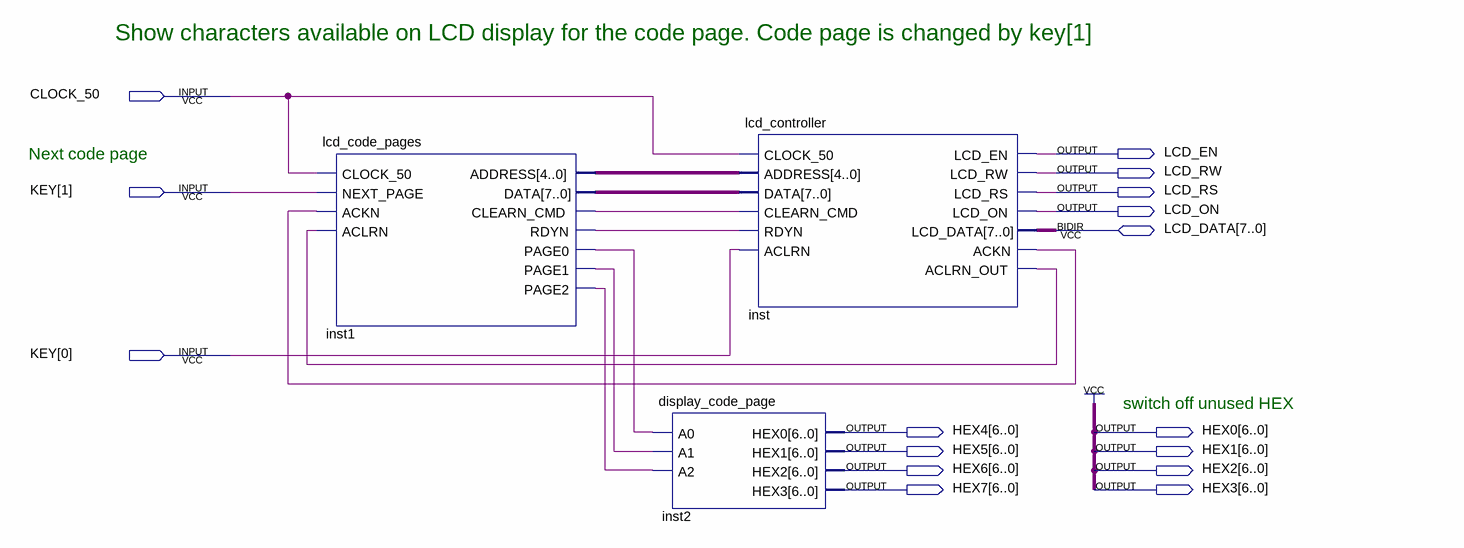
[diagram p0: schematic sheet]
// Quartus schematic lcd_demo_code_pages.bdf as structural Verilog: 3 symbols, 16 pins
module lcd_demo_code_pages (
  input  CLOCK_50,
  input  [1:0] KEY,
  inout  [7:0] LCD_DATA,
  output LCD_EN,
  output LCD_RW,
  output LCD_RS,
  output LCD_ON,
  output [6:0] HEX4,
  output [6:0] HEX0,
  output [6:0] HEX5,
  output [6:0] HEX1,
  output [6:0] HEX6,
  output [6:0] HEX2,
  output [6:0] HEX7,
  output [6:0] HEX3
);

  wire inst1_clearn_cmd, inst1_page0, inst1_page1, inst1_page2, inst1_rdyn, inst_ackn, inst_aclrn_out;
  wire [4:0] inst1_address;
  wire [7:0] inst1_data;

  lcd_code_pages inst1 (
    .CLOCK_50(CLOCK_50), .NEXT_PAGE(KEY[1]), .ACKN(inst_ackn), .ACLRN(inst_aclrn_out),
    .ADDRESS(inst1_address), .DATA(inst1_data), .CLEARN_CMD(inst1_clearn_cmd), .RDYN(inst1_rdyn),
    .PAGE0(inst1_page0), .PAGE1(inst1_page1), .PAGE2(inst1_page2));
  display_code_page inst2 (
    .A0(inst1_page0), .A1(inst1_page1), .A2(inst1_page2), .HEX0(HEX4), .HEX1(HEX5), .HEX2(HEX6), .HEX3(HEX7));
  lcd_controller inst (
    .CLOCK_50(CLOCK_50), .ADDRESS(inst1_address), .DATA(inst1_data), .CLEARN_CMD(inst1_clearn_cmd),
    .RDYN(inst1_rdyn), .ACLRN(KEY[0]), .LCD_EN(LCD_EN), .LCD_RW(LCD_RW), .LCD_RS(LCD_RS), .LCD_ON(LCD_ON),
    .ACKN(inst_ackn), .ACLRN_OUT(inst_aclrn_out), .LCD_DATA(LCD_DATA));

  assign HEX0 = {7{1'b1}};
  assign HEX1 = {7{1'b1}};
  assign HEX2 = {7{1'b1}};
  assign HEX3 = {7{1'b1}};

  // Notes on the sheet:
  //   Show characters available on LCD display for the code page. Code page is changed by key[1]
  //   Next code page
  //   switch off unused HEX
endmodule
